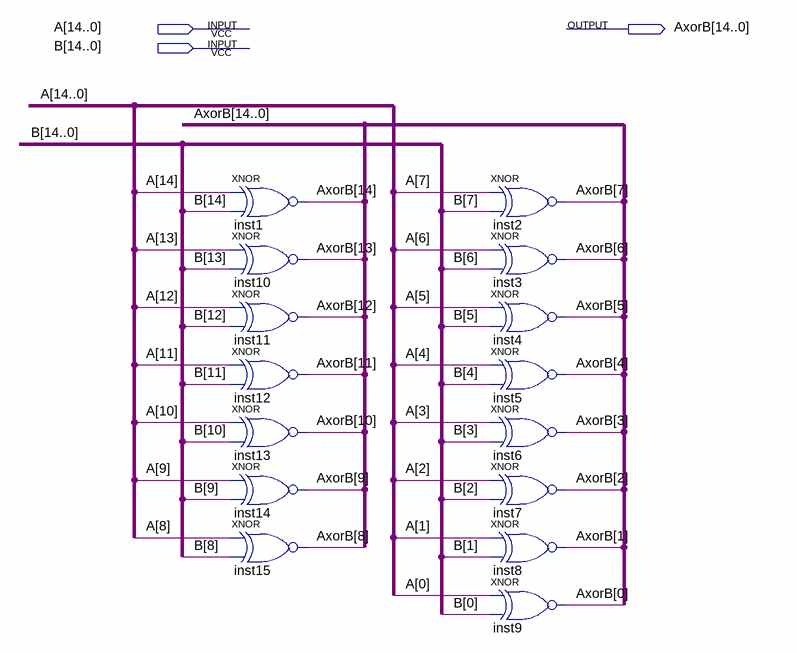
[diagram p0: schematic sheet]
// Quartus schematic lpm_nxor.bdf as structural Verilog: 15 symbols, 3 pins
module lpm_nxor (
  input  [14:0] A,
  input  [14:0] B,
  output [14:0] AxorB
);

  xnor inst1 (AxorB[14], A[14], B[14]);
  xnor inst10 (AxorB[13], A[13], B[13]);
  xnor inst11 (AxorB[12], A[12], B[12]);
  xnor inst12 (AxorB[11], A[11], B[11]);
  xnor inst13 (AxorB[10], A[10], B[10]);
  xnor inst14 (AxorB[9], A[9], B[9]);
  xnor inst15 (AxorB[8], A[8], B[8]);
  xnor inst2 (AxorB[7], A[7], B[7]);
  xnor inst3 (AxorB[6], A[6], B[6]);
  xnor inst4 (AxorB[5], A[5], B[5]);
  xnor inst5 (AxorB[4], A[4], B[4]);
  xnor inst6 (AxorB[3], A[3], B[3]);
  xnor inst7 (AxorB[2], A[2], B[2]);
  xnor inst8 (AxorB[1], A[1], B[1]);
  xnor inst9 (AxorB[0], A[0], B[0]);
endmodule
